# EAGLE design nrf51822 (EAGLE 7.2.0)
CNAME: BLEoT Actuation and high temp sensor; CREVISION: 1.0; DESIGNER: Mohammed Aljarrah
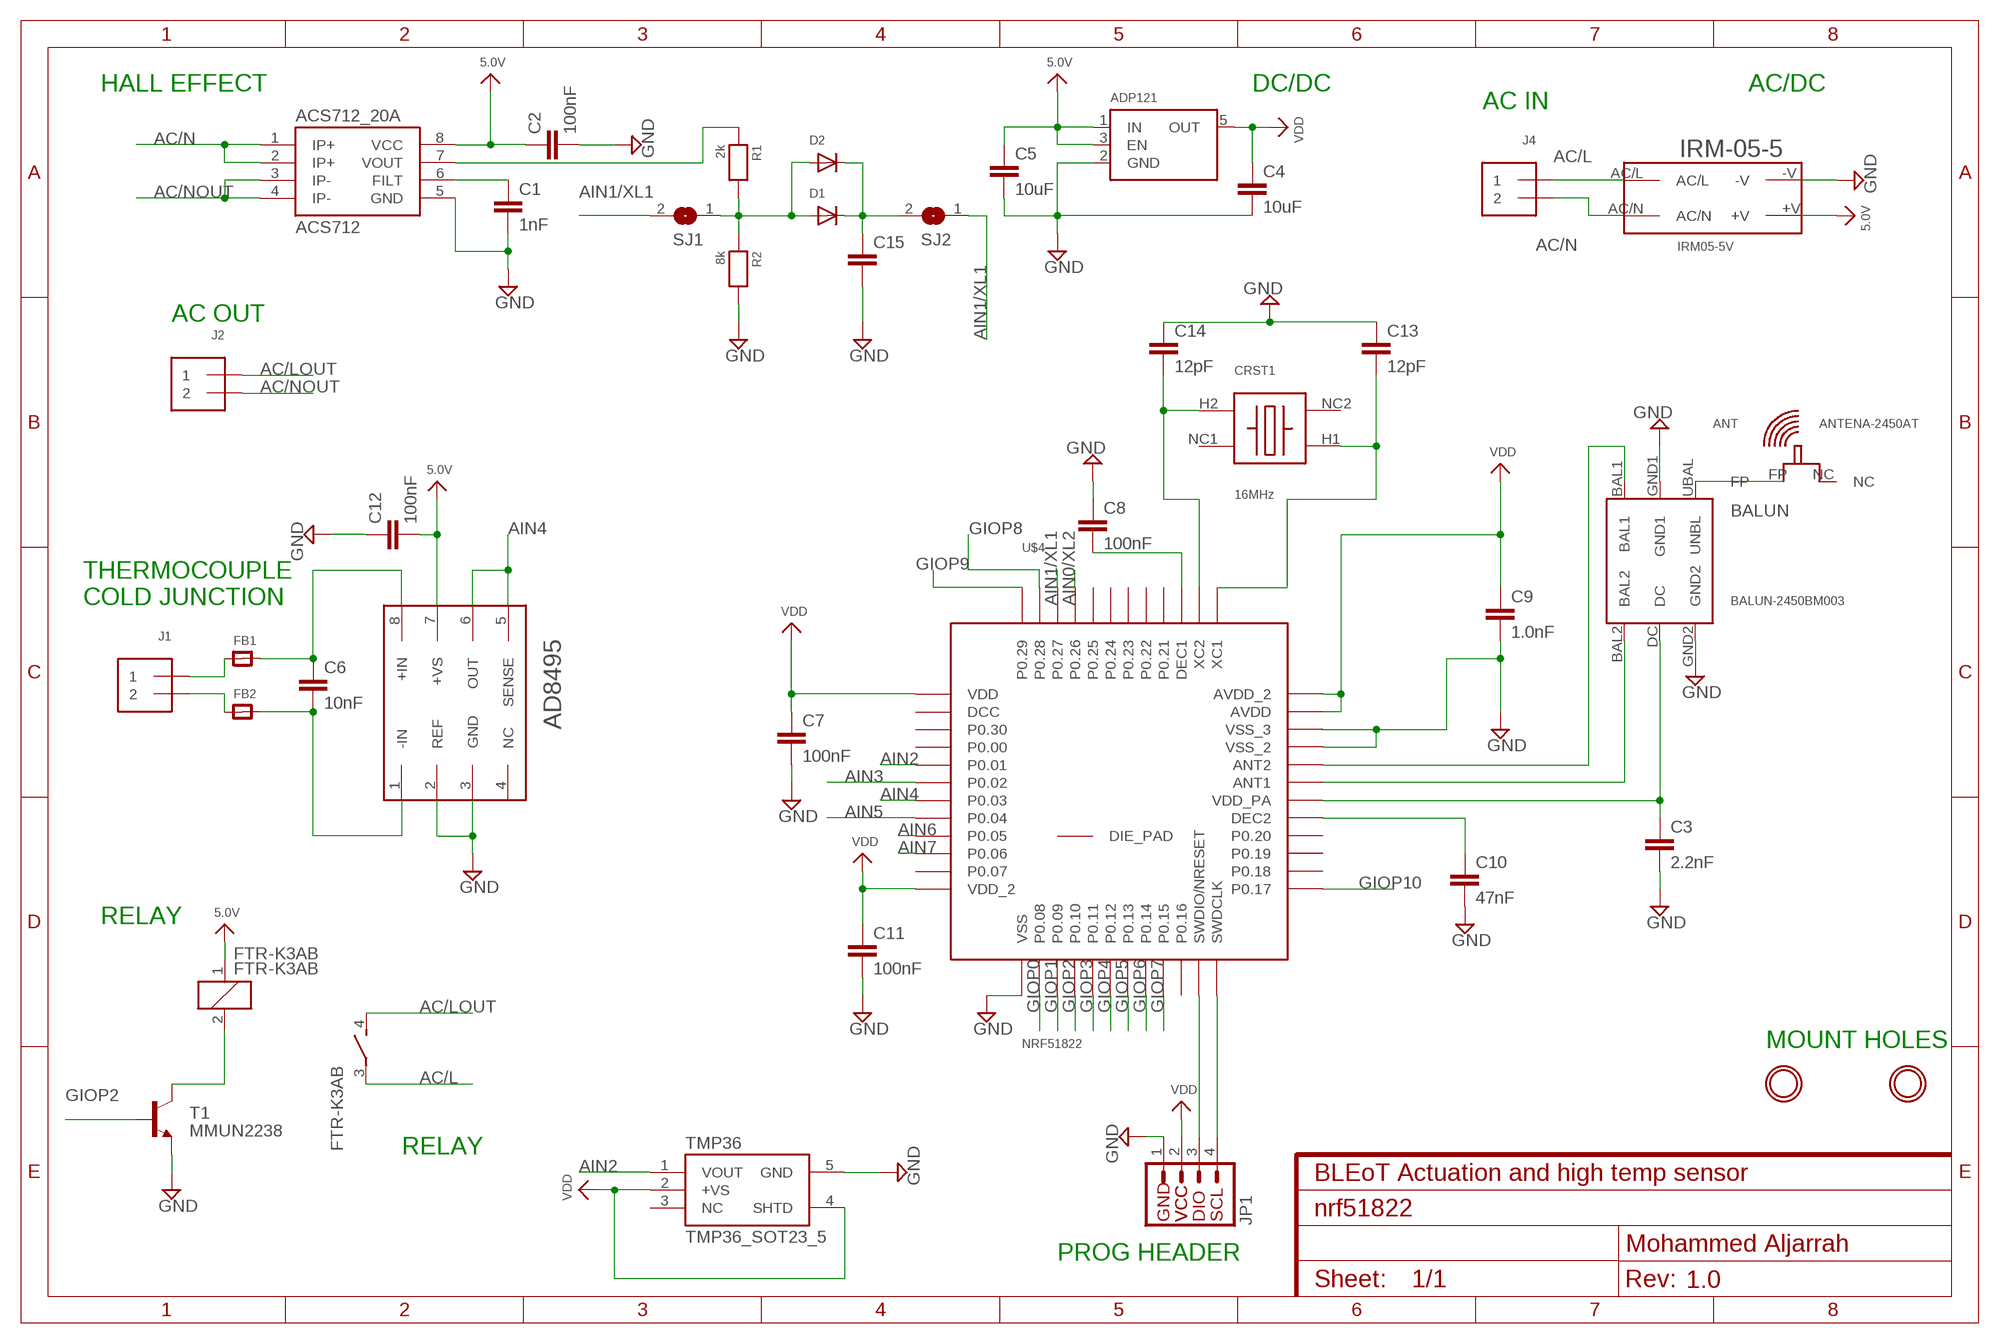
[diagram p0: schematic, sheet 1]

## Parts
ACS712_20A  ACS712  [SO08]
AD8495  AD8495  [MSOP-8]
ADP121  ADP121  [SOT23-5]
ANT  ANTENA-2450AT  [2450AT18B100]
BALUN  BALUN-2450BM003  [2450BM14E0003]
C1  1nF  C-EUC0805  [C0805]
C2  100nF  C-EUC0805  [C0805]
C3  2.2nF  C-EUC0805  [C0805]
C4  10uF  C-EUC0805  [C0805]
C5  10uF  C-EUC0805  [C0805]
C6  10nF  C-EUC0805  [C0805]
C7  100nF  C-EUC0805  [C0805]
C8  100nF  C-EUC0805  [C0805]
C9  1.0nF  C-EUC0805  [C0805]
C10  47nF  C-EUC0805  [C0805]
C11  100nF  C-EUC0805  [C0805]
C12  100nF  C-EUC0805  [C0805]
C13  12pF  C-EUC0805  [C0805]
C14  12pF  C-EUC0805  [C0805]
C15  CAPPTH3  [CAP-PTH-LARGE]
CRST1  16MHz  CX3225GB  [CRYSTAL16MHZ]
D1  DIODESOD-123  [SOD-123]
D2  DIODEDO-1N4148  [DO-1N4148]
FB1  FERRITE0805  [0805]
FB2  FERRITE0805  [0805]
FTR-K3AB  FTR-K3AB  [FTR-K1C]
IRM-05-5  IRM05-5V  [IRM05]
J1  TERMBLOCK_1X2  [TERMBLOCK_1X2-3.5MM]
J2  TERMBLOCK_1X2  [TERMBLOCK_1X2-3.5MM]
J4  TERMBLOCK_1X2  [TERMBLOCK_1X2-3.5MM]
JP1  PROG_HEADER  [1X04]
R1  2k  RESISTOR0805  [0805]
R2  8k  RESISTOR0805  [0805]
SJ1  SOLDERJUMPERREFLOW_NOPASTE  [SOLDERJUMPER_REFLOW_NOPASTE]
SJ2  SOLDERJUMPERREFLOW_NOPASTE  [SOLDERJUMPER_REFLOW_NOPASTE]
T1  MMUN2238  TRANSISTOR_NPNMMBT2222A  [SOT23-3]
TMP36  TMP36_SOT23_5  [SOT23-5]
U$1  MOUNTINGHOLE2.5  [MOUNTINGHOLE_2.5_PLATED]
U$4  NRF51822  [QFN48]
U$7  MOUNTINGHOLE2.5  [MOUNTINGHOLE_2.5_PLATED]

## Nets
5.0V: ACS712_20A.8(VCC) AD8495.7(+VS) ADP121.1(IN) ADP121.3(EN) C2.1 C5.1 C12.2 FTR-K3AB.1 IRM-05-5.+V
AC/L [antenna]: FTR-K3AB.3 IRM-05-5.AC/L J4.1
AC/LOUT [antenna]: FTR-K3AB.4 J2.1
AC/N [antenna]: ACS712_20A.1(IP+) ACS712_20A.2(IP+) IRM-05-5.AC/N J4.2
AC/NOUT [antenna]: ACS712_20A.3(IP-) ACS712_20A.4(IP-) J2.2
AIN0/XL2: U$4.45(P0.26)
AIN1/XL1: SJ1.2 SJ2.1 U$4.46(P0.27)
AIN2: TMP36.1(VOUT) U$4.5(P0.01)
AIN3: U$4.6(P0.02)
AIN4: AD8495.5(SENSE) AD8495.6(OUT) U$4.7(P0.03)
AIN5: U$4.8(P0.04)
AIN6: U$4.9(P0.05)
AIN7: U$4.10(P0.06)
GIOP0: U$4.14(P0.08)
GIOP1: U$4.15(P0.09)
GIOP2: T1.1(B) U$4.16(P0.10)
GIOP3: U$4.17(P0.11)
GIOP4: U$4.18(P0.12)
GIOP5: U$4.19(P0.13)
GIOP6: U$4.20(P0.14)
GIOP7: U$4.21(P0.15)
GIOP8: U$4.47(P0.28)
GIOP9: U$4.48(P0.29)
GIOP10: U$4.25(P0.17)
GND: ACS712_20A.5(GND) AD8495.2(REF) AD8495.3(GND) ADP121.2(GND) BALUN.GND1 BALUN.GND2 C1.2 C2.2 C3.2 C4.2 C5.2 C7.2 C8.1 C9.2 C10.2 C11.2 C12.1 C13.1 C14.1 C15.2 IRM-05-5.-V JP1.1 R2.2 T1.2(E) TMP36.5(GND) U$4.13(VSS) U$4.33(VSS_2) U$4.34(VSS_3)
N$1: C14.2 CRST1.H2 U$4.38(XC2)
N$2: C13.2 CRST1.H1 U$4.37(XC1)
N$3: ANT.FP BALUN.UBAL(UNBL)
N$4: BALUN.DC C3.1 U$4.30(VDD_PA)
N$5: C8.2 U$4.39(DEC1)
N$6: BALUN.BAL1 U$4.32(ANT2)
N$7: FTR-K3AB.2 T1.3(C)
N$8: FB1.1 J1.1
N$9: AD8495.8(+IN) C6.1 FB1.2
N$10: BALUN.BAL2 U$4.31(ANT1)
N$11: ACS712_20A.6(FILT) C1.1
N$12: JP1.3 U$4.23(SWDIO/NRESET)
N$13: C10.1 U$4.29(DEC2)
N$14: JP1.4 U$4.24(SWDCLK)
N$15: D1.A D2.A R1.2 R2.1 SJ1.1
N$16: AD8495.1(-IN) C6.2 FB2.2
N$17: FB2.1 J1.2
N$18: ACS712_20A.7(VOUT) R1.1
N$19: C15.1 D1.C D2.C SJ2.2
VDD: ADP121.5(OUT) C4.1 C7.1 C9.1 C11.1 JP1.2 TMP36.2(+VS) TMP36.4(SHTD) U$4.1(VDD) U$4.12(VDD_2) U$4.35(AVDD) U$4.36(AVDD_2)
Unconnected: AD8495.4(NC) ANT.NC CRST1.NC1 CRST1.NC2 TMP36.3(NC) U$4.2(DCC) U$4.3(P0.30) U$4.4(P0.00) U$4.11(P0.07) U$4.22(P0.16) U$4.26(P0.18) U$4.27(P0.19) U$4.28(P0.20) U$4.40(P0.21) U$4.41(P0.22) U$4.42(P0.23) U$4.43(P0.24) U$4.44(P0.25) U$4.GND(DIE_PAD)

## Notes on the sheet
- HALL EFFECT | DC/DC | AC/DC
- AC IN
- AC OUT
- THERMOCOUPLE
  COLD JUNCTION
- RELAY
- MOUNT HOLES
- RELAY
- PROG HEADER

## Library data of the parts
ACS712_20A = SparkFun-AnalogIC:ACS712: Hall-effect-based isolated linear current sensor
AD8495 = NordicSemi:AD8495: AD8495 Analog out Board Mount Temperature Sensors Thermocouple Amp w/Cold Jct Compensat Mouser Part No: 584-AD8495ARMZ Manufacturer Part No: AD8495ARMZ
ADP121 = microbuilder:ADP121: LDO Fixed Voltage Regulator 150mA The ADP121 voltage regulator is ideal for regulating battery or solar power due to it's very low foreward voltage drop (maximum 90mV at 150mA). Forward Voltage Dropout: 90mV at 150mA Input Voltage Range: 2.3V-5.5V Output Voltage Range: 1.2V-3.3V (depending on model) Digikey: 3.3V - ADP121-AUJZ33R7CT-ND Digikey: 3.0V - ADP121-AUJZ30R7CT-ND
ANT = NordicSemi:ANTENA-2450AT: General Specifications: Part Number 2450AT18B100 Input Power 3W max. Frequency Range 2400 - 2500 Mhz Impedance 50 Ω Peak Gain 0.5 dBi typ. (XZ-V) Operating Temperature -40 to +85°C Average Gain -0.5 dBi typ. (XZ-V) Reel Quanity 3,000 Return Loss 9.5 dB min
BALUN = NordicSemi:BALUN-2450BM003: 2450BM14E0003 2.45GHz Impedance Matched Balun + Band Pass Filter: Optimized for Nordic's Chipset nRF51822 and nRF51422
C1-C14 = rcl:C-EU: CAPACITOR, European symbol
C15 = SparkFun-Capacitors:CAP: Capacitor Standard 0603 ceramic capacitor, and 0.1" leaded capacitor.
CRST1 = NordicSemi:CX3225GB: Mouser: 581-CX3225GB16DHPQCC Manufacturer: CX3225GB16000D0HPQCC 16MHz 8pF +/-20ppm Features • Crystal unit for Consumer Products • Small and low profile 0.9mm max. (3.2×2.5×0.8mm) • Ceramic package • Reflow compatible
D1 = adafruit:DIODE: Diode
D2 = microbuilder:DIODE: Diode
FB1 FB2 = microbuilder:FERRITE: Ferrite Bead 0603 MMZ1608B121C - 120 Ohm @ 100MHz, 600mA, 0.15 Ohm DC Resistance - Digikey: 445-2164-1-ND BK1608HW121-T - 120 Ohm, 600mA Ferrite Chip - Digikey: 587-1876-2-ND 0805 HZ0805B272R-10 - 2.7K Ohm @ 100MHz, 200mA, 0.8 Ohm DC Resistance - Digikey: 240-2504-1-ND (see also Murata BLM21BD272SN1L) MMZ2012Y152B - 1.5K Ohm @ 100MHz, 500mA, 0.4 Ohm DC Resistance - Digikey: 445-1560-1-ND - Mainly for high frequency (80-400MHz) MMZ2012R102A - 1K Ohm @ 100MHz, 500mA, 0.3 Ohm DC Resistance - Digikey: 445-1555-2-ND - More general purpose (10-200MHz)
FTR-K3AB = NordicSemi:FTR-K3AB: 26A relay, 250 VAC, 5V coil Mouser Part No: 817-FTR-K3AB005W Manufacturer Part No: FTR-K3AB005W
IRM-05-5 = NordicSemi:IRM05-5V: Switching Power Supplies 5V 1A 5W 85-264Vin Encap PS Mouser Part No: 709-IRM05-5 Manufacturer Part No: IRM-05-5 Manufacturer: Mean Well
J1 J2 J4 = microbuilder:TERMBLOCK_1X2: 3.5mm Terminal block http://www.ladyada.net/library/pcb/eaglelibrary.html
JP1 = NordicSemi:PROG_HEADER: SparkFun has standardized on a pinout for all I2C based sensor breakouts. This pinout allows I2C boards to be plugged directly into the headers on Arduino Uno compatible boards, and to be daisy chained easily.
R1 R2 = microbuilder:RESISTOR: Resistors 0402 - 0402 Surface Mount Package 22 Ohm 1% 1/16W [Digikey: 311-22.0LRTR-ND] 33 Ohm 5% 1/16W 1.0K 5% 1/16W 1.5K 5% 1/16W 2.0K 1% 1/16W 10.0K 1% 1/16W [Digikey: 311-10.0KLRTR-ND] 10.0K 5% 1/16W [Digikey: RMCF0402JT10K0TR-ND] 12.1K 1% 1/16W [Digikey: 311-22.0LRTR-ND] 100.0K 5% 1/16W 0603 - 0603 Surface Mount Package 0 Ohm 1/10 Watt 1% Resistor 15 Ohm 1/10 Watt 1% Resistor 33 Ohm 1/10 Watt 1% Resistor 49.9 Ohm 1/10 Watt 1% Resistor 100 Ohm 1/10 Watt 1% Resistor 150 Ohm 1/10 Watt 1% Resistor 240 Ohm 1/10 Watt 1% Resistor 390 Ohm 1/10 Watt 1% Resistor 560 Ohm 1/10 Watt 1% Resistor 680 Ohm 1/10 Watt 1% Resistor 750 Ohm 1/10 Watt 1% Resistor 1.0K Ohm 1/10 Watt 1% Resistor 1.5K Ohm 1/10 Watt 1% Resistor 2.0K Ohm 1/10 Watt 1% Resistor 2.2K Ohm 1/10 Watt 1% Resistor 3.3K Ohm 1/10 Watt 1% Resistor 4.7K Ohm 1/10 Watt 1% Resistor 10.0K Ohm 1/10 Watt 1% Resistor 12.0K Ohm 1/10 Watt 1% Resistor 12.1K Ohm 1/10 Watt 1% Resistor 20.0K Ohm 1/10 Watt 1% Resistor 33.0K Ohm 1/10 Watt 1% Resistor 100.0K Ohm 1/10 Watt 1% Resistor 0805 - 0805 Surface Mount Package 0 Ohm 1/8 Watt 1% Resistor 33 Ohm 1/8 Watt 1% Resistor 100 Ohm 1/8 Watt 1% Resistor 150 Ohm 1/8 Watt 1% Resistor 200 Ohm 1/8 Watt 1% Resistor 240 Ohm 1/8 Watt 1% Resistor 330 Ohm 1/8 Watt 1% Resistor 390 Ohm 1/8 Watt 1% Resistor 470 Ohm 1/8 Watt 1% Resistor 1.0K Ohm 1/8 Watt 1% Resistor 1.5K Ohm 1/8 Watt 1% Resistor 2.0K Ohm 1/8 Watt 1% Resistor 4.7K Ohm 1/8 Watt 1% Resistor 5.1K Ohm 1/8 Watt 1% Resistor 5.6K Ohm 1/8 Watt 1% Resistor 10.0K Ohm 1/8 Watt 1% Resistor 22.0K Ohm 1/8 Watt 1% Resistor 33.0K Ohm 1/8 Watt 1% Resistor 100K Ohm 1/8 Watt 1% Resistor 1206 - 1206 Surface Mount Package 2012 - 2010 Surface Mount Package 0.11 Ohm 1/2 Watt 1% Resistor - Digikey: RHM.11UCT-ND
SJ1 SJ2 = microbuilder:SOLDERJUMPER: SMD Solder JUMPER Solder the two pads together to create a connection, or remove the solder to break it. REFLOW - Use this footprint for solder paste and reflow ovens. WAVE - Use this footprint for hand-soldering (larger pads). CLOSED - Has a trace between the two pads to ensure it is closed by default. The trace needs to be cut to disable the jumper, and can be closed again by creating a solder bridge between the two pads.
T1 = SparkFun-DiscreteSemi:TRANSISTOR_NPN: Generic NPN BJT MMBT2222A - TRANS-08049 (SOT-23, 1A 40V) MPSA42 - TRANS-09116 (SOT-23, 500mA 300V) MMBT5088LT1G - TRANS-11160 (SOT-23, 50 mA 30V) BC547 - COM-08928 <http://www.sparkfun.com/products/8928> (TO-92 45V 100mA) (1.Collector 2.Base 3.Emitter) 2N3904 - COM-00521 <http://www.sparkfun.com/products/521> (TO-92 40V 200mA) (1.Emitter 2.Base 3.Collector) P2N2222A - COM-12852 <http://www.sparkfun.com/products/12852> (TO-92 40V 600mA) (1.Collector 2.Base 3.Emitter); PROD_ID: TRANS-08049; VALUE: MMBT2222A
TMP36 = NordicSemi:TMP36_SOT23_5: TMP36 analog temp sensor Mouser Part No: 584-TMP36GRTZ-R7 Manufacturer Part No: TMP36GRTZ-REEL7
U$1 U$7 = microbuilder:MOUNTINGHOLE: Mounting Hole For #2 screws (0.086"/2.18mm width, 0.094"/2.4mm hole) use 2.5mm
U$4 = NordicSemi:NRF51822: Bluetooth 4.0 Low Energy/2.4Ghz NORDIC SEMICONDUCTOR

## Net classes
0 default: width 0.152 mm, drill 0.508 mm, clearance 0.152 mm
1 antenna: width 0.152 mm, drill 0.508 mm, clearance 0.406 mm to class 0, clearance 0.406 mm

## Board
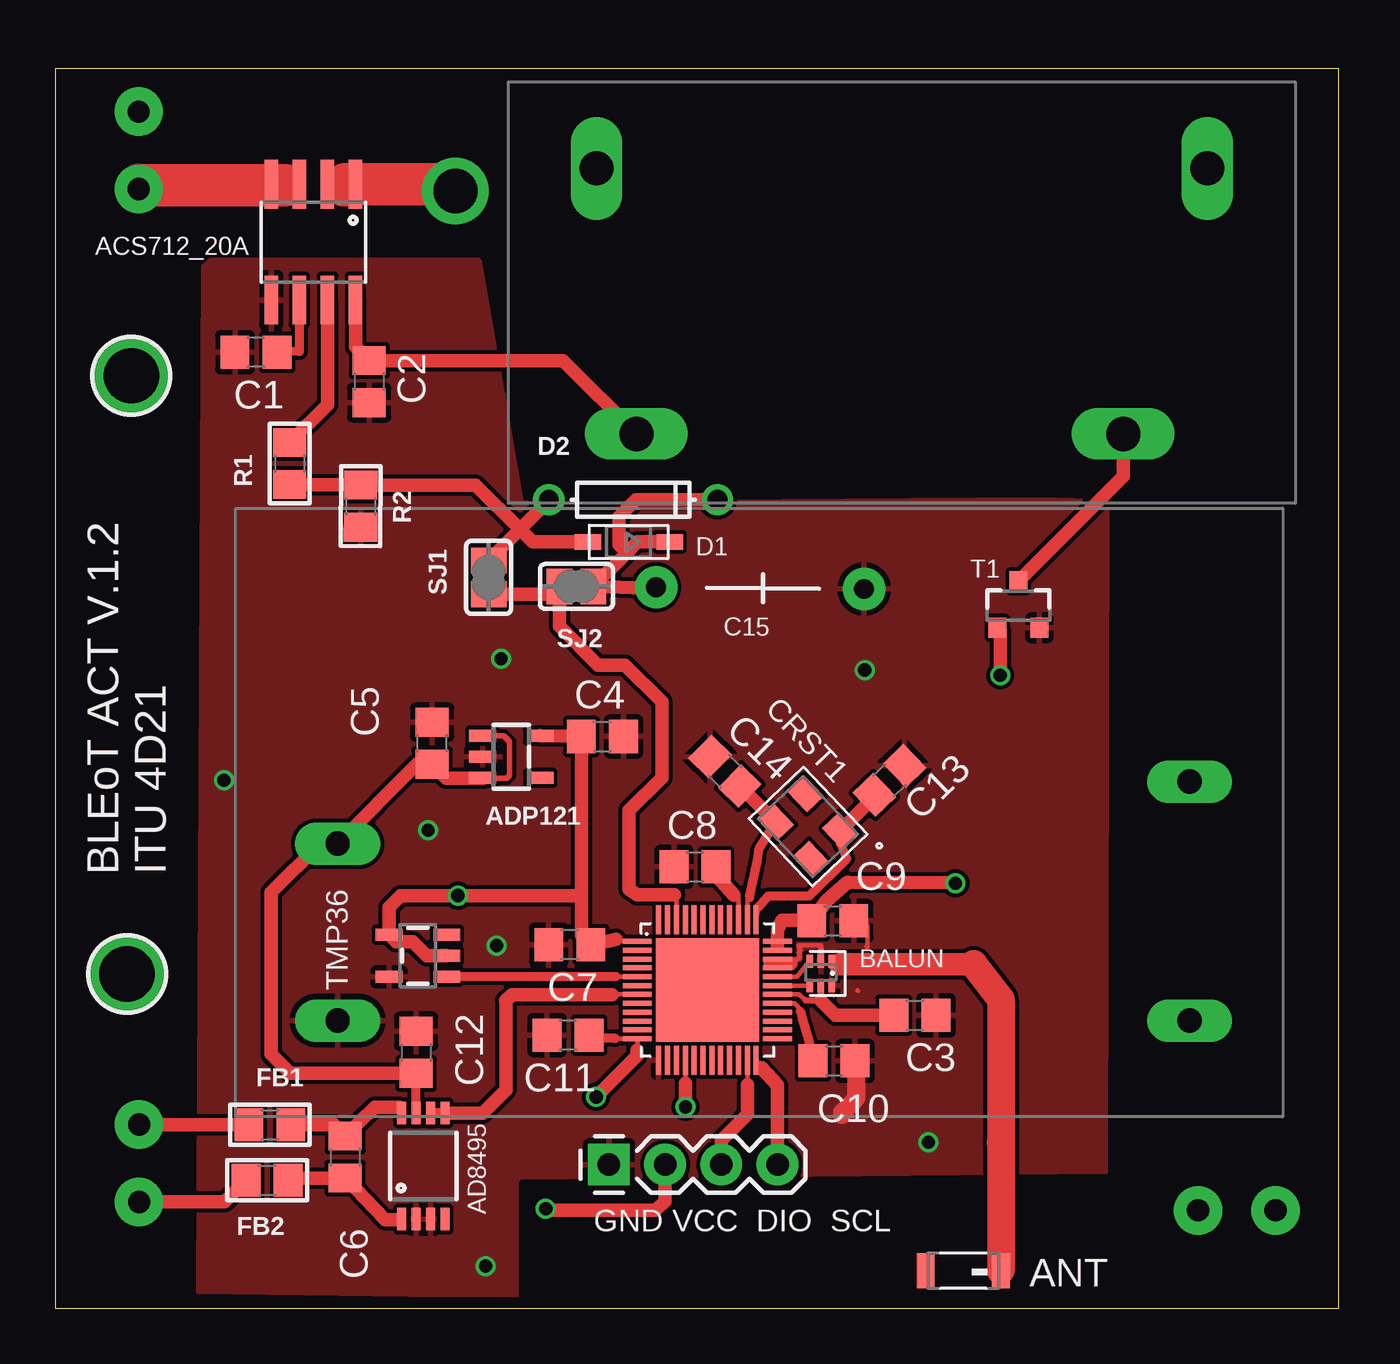
[diagram p1: board, top side]
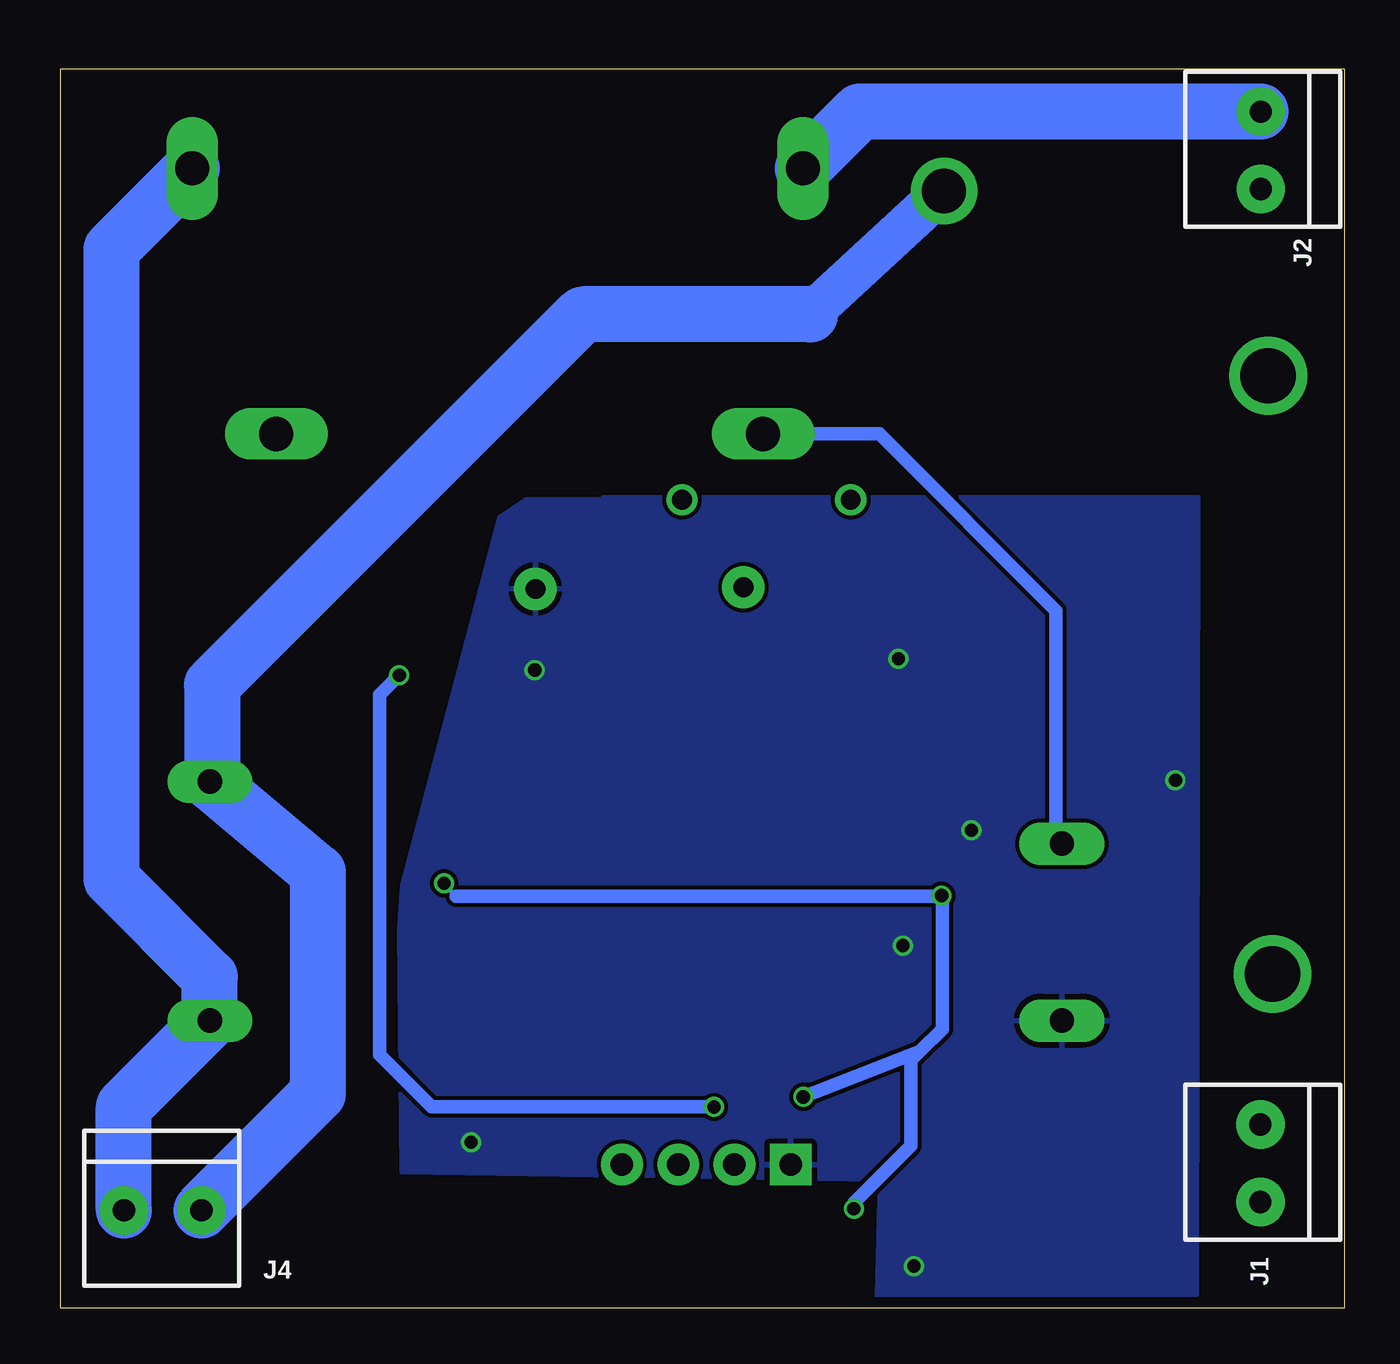
[diagram p2: board, bottom side, seen from below]

Size 58 x 56 mm. Coordinates in mm from the lower left corner, seen from the top.
Outline: 0,0 58,0 58,56 0,56 0,0
Copper layers (1*16): Top 0.035mm / dielectric 1.5mm / Bottom 0.035mm
Design rules "4D21": minimum track width 8mil, minimum drill 12mil, track to track 7mil, track to pad 6mil, pad to pad 6mil, via to via 7mil, smd to smd 0mil, copper to edge 20mil, drill to drill 10mil, minimum pad ring 10mil, minimum via ring 6mil, stop-mask expansion 2mil, vias tented up to drill 25mil, thermal gap 10mil

### Footprints (pad centres in the part's own frame; a part is rotated, then mirrored left to right if it is on the bottom)
SO08 = smd 0.61 x 2.21: 1 -1.905,-2.616; 2 -0.635,-2.616; 3 0.635,-2.616; 4 1.905,-2.616; 5 1.905,2.616; 6 0.635,2.616; 7 -0.635,2.616; 8 -1.905,2.616
MSOP-8 = smd 0.41 x 1.02: 1 -0.975,-2.4; 2 -0.325,-2.4; 3 0.325,-2.4; 4 0.975,-2.4; 5 0.975,2.4; 6 0.325,2.4; 7 -0.325,2.4; 8 -0.975,2.4
SOT23-5 = smd 0.55 x 1.2: 1 -0.95,-1.3; 2 0,-1.3; 3 0.95,-1.3; 4 0.95,1.3; 5 -0.95,1.3
2450AT18B100 = smd 0.8 x 1.6: FP -1.7,0; NC 1.7,0
2450BM14E0003 = smd 0.3 x 0.6: BAL1 0,0.05; BAL2 0,-1.05; DC 0.5,-1.05; GND1 0.5,0.05; GND2 1,-1.05; UBAL 1,0.05
C0805 = smd 1.3 x 1.5: 1 -0.95,0; 2 0.95,0
CAP-PTH-LARGE = drill 0.9 pad 1.905: 1 -4.826,0; 2 4.572,0
CRYSTAL16MHZ = smd 1.3 x 1.05: H1 -1.15,-0.925; H2 1.15,0.925; NC1 -1.15,0.925; NC2 1.15,-0.925
SOD-123 = smd 1.2 x 0.7: A 1.85,0; C -1.85,0
DO-1N4148 = drill 0.9: A -3.81,0; C 3.81,0
0805 = smd 1.3 x 1.5: 1 -0.95,0; 2 0.95,0
FTR-K1C = drill 1.55 pad 1.9 long: 1 -12,-5.75; 2 10,-5.75; 3 13.8,6.25; 4 -13.8,6.25
IRM05 = drill 1.1 pad 1.93 long: +V 38.5,2.75; -V 38.5,10.75; AC/L 0,10.75; AC/N 0,-0.05
TERMBLOCK_1X2-3.5MM = drill 1 pad 2.184: 1 1.8,0; 2 -1.7,0
1X04 = drill 1.016 pad 1.88 square: 1 0,0 | drill 1.016 pad 1.88: 2 2.54,0; 3 5.08,0; 4 7.62,0
SOLDERJUMPER_REFLOW_NOPASTE = smd 1.168 x 1.6: 1 -0.762,0; 2 0.762,0
SOT23-3 = smd 0.8 x 0.9: 1 -0.95,-1; 2 0.95,-1; 3 0,1.1
MOUNTINGHOLE_2.5_PLATED = drill 2.5 pad 3.2: P$1 0,0
QFN48 = smd 1.3 x 0.226: 1 -3.17,2.2; 2 -3.17,1.8; 3 -3.17,1.4; 4 -3.17,1; 5 -3.17,0.6; 6 -3.17,0.2; 7 -3.17,-0.2; 8 -3.17,-0.6; 9 -3.17,-1; 10 -3.17,-1.4; 11 -3.17,-1.8; 12 -3.17,-2.2; 25 3.17,-2.2; 26 3.17,-1.8; 27 3.17,-1.4; 28 3.17,-1; 29 3.17,-0.6; 30 3.17,-0.2; 31 3.17,0.2; 32 3.17,0.6; 33 3.17,1; 34 3.17,1.4; 35 3.17,1.8; 36 3.17,2.2 | smd 0.226 x 1.3: 13 -2.2,-3.17; 14 -1.8,-3.17; 15 -1.4,-3.17; 16 -1,-3.17; 17 -0.6,-3.17; 18 -0.2,-3.17; 19 0.2,-3.17; 20 0.6,-3.17; 21 1,-3.17; 22 1.4,-3.17; 23 1.8,-3.17; 24 2.2,-3.17; 37 2.2,3.17; 38 1.8,3.17; 39 1.4,3.17; 40 1,3.17; 41 0.6,3.17; 42 0.2,3.17; 43 -0.2,3.17; 44 -0.6,3.17; 45 -1,3.17; 46 -1.4,3.17; 47 -1.8,3.17; 48 -2.2,3.17 | smd 4.66 x 4.66: GND 0,0

### Placement (x,y rotation side)
ACS712_20A  11.66,48.16 180 top
AD8495  16.63,6.43 0 top
ADP121  20.61,24.91 270 top
ANT  41.03,1.7 180 top
BALUN  34.09,15.63 0 top
C1  9.07,43.18 180 top
C2  14.18,41.86 270 top
C3  38.84,13.24 0 top
C4  24.72,25.83 0 top
C5  17.03,25.52 90 top
C6  13.1,6.84 270 top
C7  23.25,16.43 180 top
C8  28.91,19.94 0 top
C9  35.13,17.5 0 top
C10  35.18,11.18 0 top
C11  23.17,12.34 180 top
C12  16.31,11.56 270 top
C13  37.7,23.85 224 top
C14  30.25,24.26 315.4 top
C15  31.98,32.53 359.5 top
CRST1  34.01,21.76 133.4 top
D1  25.91,34.62 180 top
D2  26.11,36.52 0 top
FB1  9.7,8.29 0 top
FB2  9.57,5.78 0 top
FTR-K3AB  38.26,45.25 0 top
IRM-05-5  51.26,23.75 180 top
J1  3.78,6.5 90 bottom
J2  3.77,52.26 90 bottom
J4  53.34,4.43 180 bottom
JP1  25.01,6.49 0 top
R1  10.59,38.16 270 top
R2  13.8,36.23 269.7 top
SJ1  19.58,33.02 270 top
SJ2  23.55,32.61 0 top
T1  43.52,31.74 0 top
TMP36  16.38,15.92 90 top
U$1  3.24,15.1 0 top
U$4  29.47,14.38 0 top
U$7  3.44,42.12 0 top

### Tracks (layer width: path | path; a pad name or v marks a point on that pad's centre or on a via)
5.0V
  Top 0.254: ADP121.1 20.26,25.86 20.52,25.6 20.52,24.08 20.39,23.95 ADP121.3
  Top 0.406: AD8495.7 16.3,10.19
  Top 0.61: 16.3,10.19 C12.2 10.62,10.61 9.75,11.48 9.75,18.79 11.96,21 IRM-05-5.+V 16.33,24.57 C5.1 17.65,23.95 ADP121.3 | ACS712_20A.8 13.57,43.43 C2.1 22.94,42.81 FTR-K3AB.1
  Bottom 0.61: FTR-K3AB.1 21.01,39.49 13.03,31.52 13.03,21.27 IRM-05-5.+V
AC/L
  Bottom 2.54: FTR-K3AB.3 55.7,47.85 55.7,19.4 51.26,14.96 IRM-05-5.AC/L 55.14,9.11 J4.1
AC/LOUT
  Bottom 2.54: J2.1 21.9,54.06 FTR-K3AB.4
AC/N  (via drill 2)
  Top 0.61: ACS712_20A.2 ACS712_20A.1
  Top 1.676: 12.96,50.72 13.05,50.73 ACS712_20A.1
  Top 1.93: v18.08,50.47 18.06,50.44 17.73,50.77 13.09,50.77 13.05,50.73
  Bottom 1.93: v18.08,50.47 18.57,50.06 24.13,44.9
  Bottom 2.54: 24.13,44.9 34.42,44.9 51.16,28.16 51.16,23.9 IRM-05-5.AC/N 50.9,23.49 46.38,19.71 46.38,9.69 J4.2
AC/NOUT
  Top 0.61: ACS712_20A.3 ACS712_20A.4
  Top 1.676: 10.38,50.74 ACS712_20A.4 | 3.77,50.74 J2.2
  Top 1.93: 10.38,50.74 3.77,50.74
AIN1/XL1
  Top 0.203: U$4.46 28.07,18.54
  Top 0.305: 28.07,18.54 28.02,18.54 27.99,18.69 | 25.93,18.92 25.93,18.95
  Top 0.61: 27.99,18.69 26.29,18.69 25.93,18.92 | 25.93,18.95 25.93,22.5 27.41,23.97 27.41,27.4 25.75,29.05 24.54,29.05 22.78,30.81 SJ2.1 22.43,32.26 SJ1.2
AIN2
  Top 0.203: TMP36.1 | U$4.5 25.15,14.98 25.32,14.98
  Top 0.406: 25.32,14.98 17.69,14.98 TMP36.1
AIN4
  Top 0.203: U$4.7 24.87,14.18 25.15,14.18
  Top 0.406: AD8495.5 AD8495.6
  Top 0.61: 25.15,14.18 20.63,14.18 20.35,13.89 20.37,13.88 20.37,9.88 19.31,8.81 17.62,8.81 AD8495.5
GIOP2  (via drill 0.6)
  Top 0.203: U$4.16 28.47,10.17 28.48,10.16
  Top 0.61: 28.48,10.16 v28.48,9.1 | v42.7,28.6 42.7,30.61 T1.1
  Bottom 0.61: v28.48,9.1 41.23,9.1 43.59,11.45 43.59,27.71 v42.7,28.6
GND  (via drill 0.6)
  Top 0.203: U$4.33 U$4.34 32.31,15.59 | 36.26,14.37 36.28,14.35 | 36.66,16.33 36.71,16.33 36.71,17.29 C9.2 | 34.59,16.22 34.58,16.33 | BALUN.GND1 34.59,15.5 34.59,16.41 33.6,16.41 33.6,16.38 33.65,16.38
  Top 0.254: 33.65,16.38 33.63,15.85 33.25,15.59
  Top 0.305: BALUN.GND1 34.59,16.22
  Top 0.61: 33.25,15.59 32.31,15.59
  Top 0.813: 35.56,8.74 35.56,8.86 36.2,9.5 36.2,11.11 C10.2
  other vias: 39.46,7.51 19.44,1.91 19.94,16.38 36.58,28.83 7.62,23.85 20.15,29.34 16.84,21.59
  pour Top: 6.46,0.74 6.68,47.04 7.01,47.37 19.11,47.37 19.16,47.32 21.06,36.43 21.11,36.37 44.54,36.55 47.53,36.45 47.48,6.17 45.26,6.14 20.98,5.89 20.83,5.74 20.83,0.13 20.73,0.54
  pour Bottom: 36.98,36.55 38.16,35.76 42.57,19.08 42.7,17.07 42.6,6.14 20.98,5.82 21.11,0.54 6.66,0.61 6.58,36.63 33.48,36.63 33.48,36.55
N$1
  Top 0.203: U$4.38 31.27,18.62 31.37,18.56
  Top 0.406: CRST1.H2 31.8,20.76 31.72,20.23 31.37,18.56
  Top 0.61: CRST1.H2 32.55,21.97 C14.2
N$2
  Top 0.203: U$4.37 31.77,18.12 | CRST1.H1 35.48,20.99 | 35.69,20.5 35.77,20.32
  Top 0.406: 31.77,18.12 32.21,18.62 34.07,18.62 35.77,20.32 | 35.48,20.99 35.69,20.5
  Top 0.61: C13.2 37.01,23.1 CRST1.H1
N$3
  Top 0.254: BALUN.UBAL 35.94,15.4
  Top 0.406: 35.94,15.4 35.45,15.54
  Top 1.016: 41.51,15.54 35.45,15.54
  Top 1.27: 41.51,15.54 42.73,13.97 42.73,7.49 ANT.FP
N$4
  Top 0.203: U$4.30 33.59,14.18 33.91,13.92
  Top 0.305: 33.91,13.92 34.59,13.89 34.59,13.9 BALUN.DC
  Top 0.61: C3.1 35.25,13.23 34.59,13.89
N$5
  Top 0.203: U$4.39 30.87,18.51 30.67,18.66
  Top 0.61: C8.2 29.92,19.5 30.67,18.66
N$6
  Top 0.203: U$4.32 33.52,14.98 BALUN.BAL1
N$7
  Top 0.61: FTR-K3AB.2 48.26,37.58 T1.3
N$8
  Top 0.61: FB1.1 3.79,8.29 J1.1
N$9
  Top 0.406: AD8495.8 15.65,8.54 15.65,8.51 15.65,8.99 15.54,9.09
  Top 0.61: 15.54,9.09 14.43,9.09 C6.1 12.59,8.29 FB1.2
N$10
  Top 0.203: U$4.31 33.7,14.58 BALUN.BAL2
N$11
  Top 0.406: ACS712_20A.6 11.03,43.23 C1.1
N$12
  Top 0.203: 31.27,9.93 U$4.23
  Top 0.61: JP1.3 30.09,7.59 31.27,8.76 31.27,10.11 31.27,9.93
N$13
  Top 0.203: U$4.29 33.41,13.78 33.58,13.61 33.66,13.41
  Top 0.406: C10.1 34.04,12.13 33.76,13.05 33.66,13.41
N$14
  Top 0.203: 31.9,10.87 32.26,10.62 U$4.24
  Top 0.61: JP1.4 32.63,10.09 31.9,10.87
N$15
  Top 0.61: 19.56,33.8 SJ1.1 20.99,35.19 | D2.A 22.3,36.5 20.99,35.19 | D1.A 21.56,34.62 20.99,35.19 | R1.2 13.77,37.21 R2.1 19,37.18 20.99,35.19
N$16
  Top 0.406: 15.56,4.01 AD8495.1
  Top 0.61: 15.56,4.01 14.91,4.01 C6.2 10.62,5.88 FB2.2
N$17
  Top 0.61: J1.2 7.64,4.8 FB2.1
N$18
  Top 0.61: 12.31,45.55 ACS712_20A.7 12.3,40.82 R1.1
N$19
  Top 0.61: 28.02,34.62 D1.C 26.31,34.62 25.83,34.13 | C15.1 26.12,32.56 SJ2.2 25.83,34.13 | D2.C 26.24,36.52 25.48,35.76 25.48,34.49 25.83,34.13
VDD  (via drill 0.6)
  Top 0.203: U$4.1 25.34,16.58 25.33,16.66 | 26.29,11.66 26.3,11.66 U$4.12 25.32,12.18 25.3,12.19 | 34.02,17.27 34.27,17.52 34.27,17.78 35.82,19.25 | 40.65,19.23 v40.67,19.2 | U$4.36 U$4.35
  Top 0.254: 35.82,19.25 35.79,19.25 35.77,19.23
  Top 0.406: 24.18,25.91 C4.1 | 25.3,12.19 24.27,12.19 C11.1
  Top 0.61: ADP121.5 C4.1 23.77,18.64 | C9.1 34.84,18.4 35.77,19.23 | 23.77,18.64 23.77,16.85 C7.1 25.07,16.61 25.33,16.66 | 23.77,18.64 v18.19,18.64 15.6,18.64 15.08,18.13 TMP36.4 15.4,16.56 16.15,16.56 16.79,15.92 TMP36.2 | 26.29,11.66 26.29,11.4 v24.44,9.55 | 35.82,19.25 40.65,19.23 | 34.27,17.52 32.84,17.52 32.64,17.09 32.64,16.4 U$4.36 | JP1.2 27.55,4.85 27.13,4.42 22.24,4.42 v22.16,4.5
  Bottom 0.203: v40.67,19.2 40.67,19.15 40.14,18.62 | 18.22,18.62 v18.19,18.64
  Bottom 0.61: v18.19,18.64 18.17,18.62 18.17,12.62 19.18,11.61 | v24.44,9.55 19.18,11.61 | 40.14,18.62 18.22,18.62 | 19.18,11.61 19.58,11.2 19.58,7.34 22.16,4.76 v22.16,4.5

### Text on the board
tPlace: BLEoT ACT V.1.2 / ITU 4D21 | GND VCC DIO SCL